# EAGLE design LowVBoard_01 (EAGLE 9.2.2)
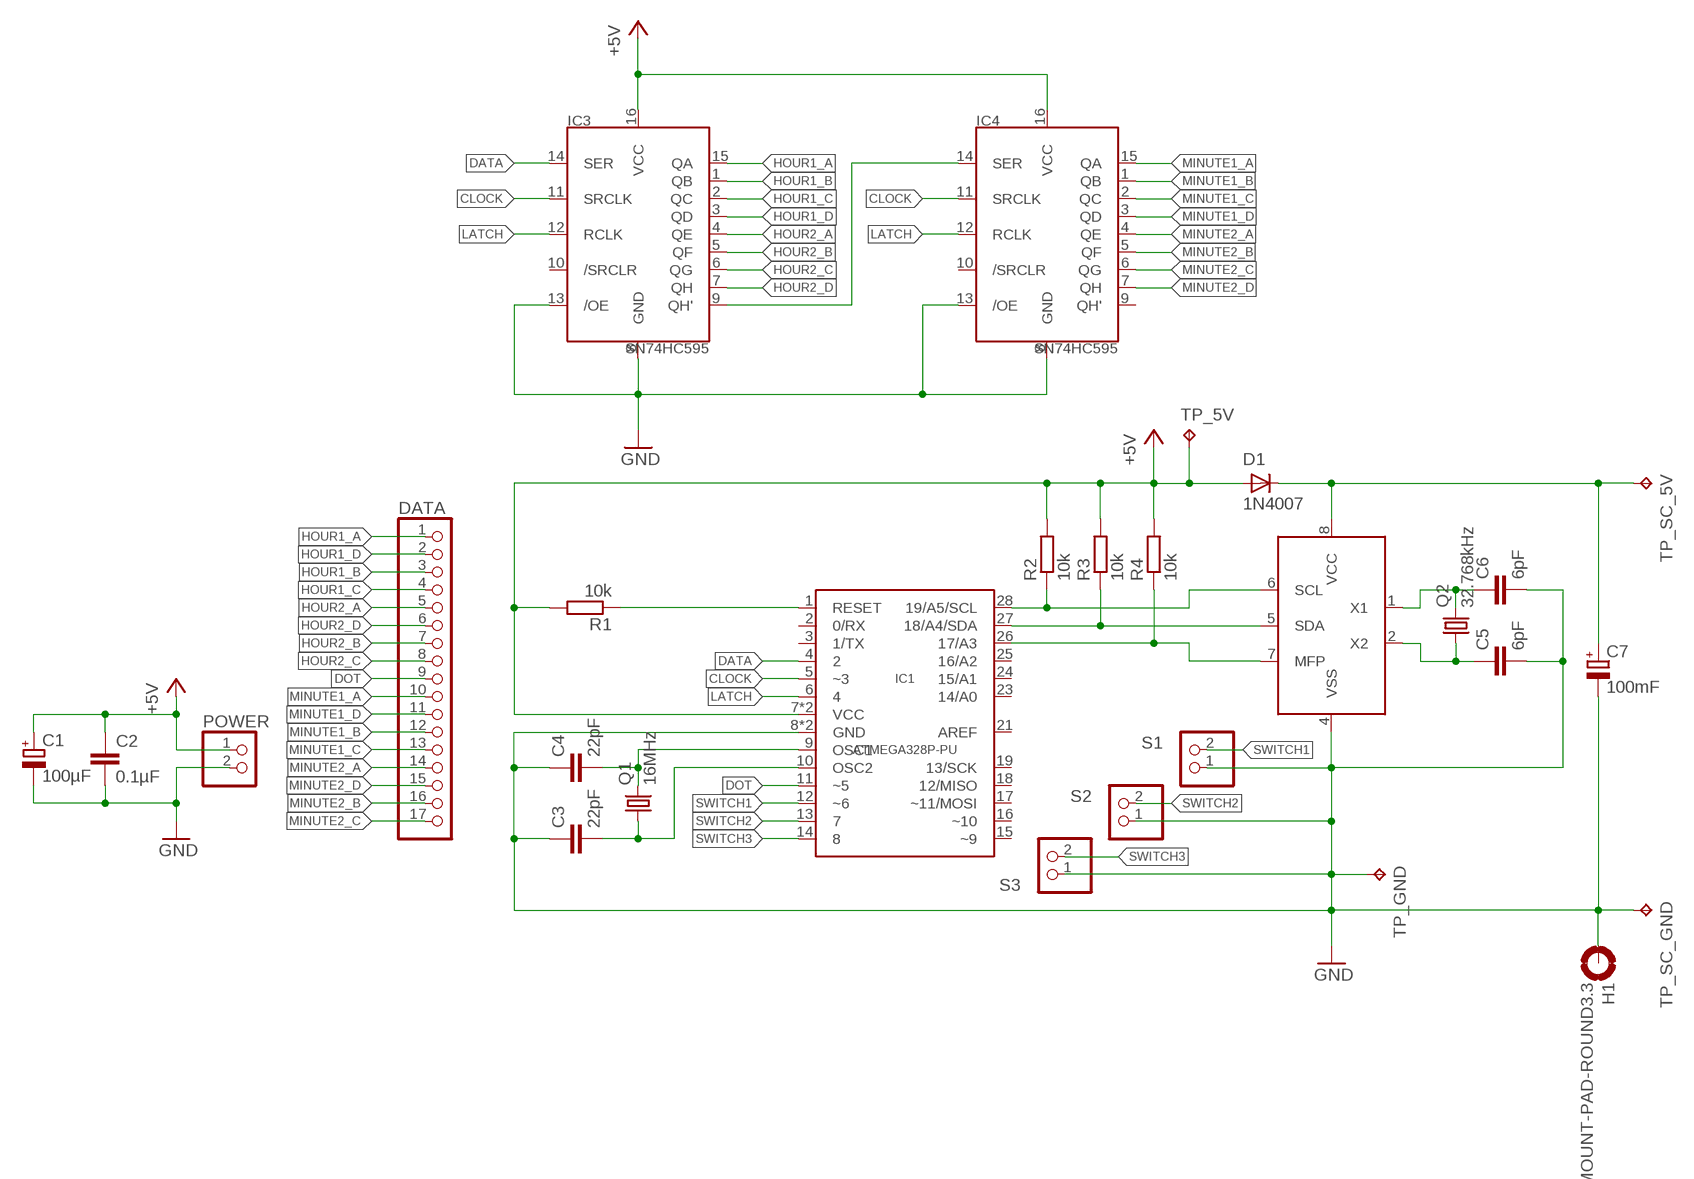
[diagram p0: schematic, sheet 1]

## Parts
C1  100µF  CPOL-EUE2-5  [E2-5]
C2  0.1µF  C-EU025-024X044  [C025-024X044]
C3  22pF  C-EU025-024X044  [C025-024X044]
C4  22pF  C-EU025-024X044  [C025-024X044]
C5  6pF  C-EU025-024X044  [C025-024X044]
C6  6pF  C-EU025-024X044  [C025-024X044]
C7  100mF  FTW0H104ZF  [SUPERCAP-11.5]
D1  1N4007  [DO41-7.6]
DATA  PINHD-1X17  [1X17]
H1  MOUNT-PAD-ROUND3.3  [3,3-PAD]
IC1  ATMEGA328P-PU  [DIP28]
IC2  MCP7940M  MCP7940M-I/P  [DIL8]
IC3  SN74HC595  [DIL16]
IC4  SN74HC595  [DIL16]
POWER  PINHD-1X2  [1X02]
Q1  16MHz  CRYSTALHC49S  [HC49/S]
Q2  32.768kHz  CFS-206  [CFS-206]
R1  10k  R-EU_0207/7  [0207/7]
R2  10k  R-EU_0207/7  [0207/7]
R3  10k  R-EU_0207/7  [0207/7]
R4  10k  R-EU_0207/7  [0207/7]
S1  PINHD-1X2/90  [1X02/90]
S2  PINHD-1X2/90  [1X02/90]
S3  PINHD-1X2/90  [1X02/90]
TP_5V  TPPAD1-13  [P1-13]
TP_GND  TPPAD1-13  [P1-13]
TP_SC_5V  TPPAD1-13  [P1-13]
TP_SC_GND  TPPAD1-13  [P1-13]

## Nets
+5V [+5V]: C1.+ C2.1 D1.A IC1.7(VCC) IC1.20(VCC) IC3.16(VCC) IC4.16(VCC) POWER.1 R1.2 R2.2 R3.2 R4.2 TP_5V.TP
CLOCK: IC1.5(~3) IC3.11(SRCLK) IC4.11(SRCLK)
DATA: IC1.4 IC3.14(SER)
DOT: DATA.9 IC1.11(~5)
GND [GND]: C1.- C2.2 C3.1 C4.1 C5.2 C6.2 C7.- H1.B3,3(MOUNT) IC1.8(GND) IC1.22(GND) IC2.4(VSS) IC3.8(GND) IC3.13(/OE) IC4.8(GND) IC4.13(/OE) POWER.2 S1.1 S2.1 S3.1 TP_GND.TP TP_SC_GND.TP
HOUR1_A: DATA.1 IC3.15(QA)
HOUR1_B: DATA.3 IC3.1(QB)
HOUR1_C: DATA.4 IC3.2(QC)
HOUR1_D: DATA.2 IC3.3(QD)
HOUR2_A: DATA.5 IC3.4(QE)
HOUR2_B: DATA.7 IC3.5(QF)
HOUR2_C: DATA.8 IC3.6(QG)
HOUR2_D: DATA.6 IC3.7(QH)
LATCH: IC1.6 IC3.12(RCLK) IC4.12(RCLK)
MINUTE1_A: DATA.10 IC4.15(QA)
MINUTE1_B: DATA.12 IC4.1(QB)
MINUTE1_C: DATA.13 IC4.2(QC)
MINUTE1_D: DATA.11 IC4.3(QD)
MINUTE2_A: DATA.14 IC4.4(QE)
MINUTE2_B: DATA.16 IC4.5(QF)
MINUTE2_C: DATA.17 IC4.6(QG)
MINUTE2_D: DATA.15 IC4.7(QH)
N$1: C7.+ D1.C IC2.8(VCC) TP_SC_5V.TP
N$53: C4.2 IC1.9(OSC1) Q1.2
N$54: C3.2 IC1.10(OSC2) Q1.1
N$56: IC1.1(RESET) R1.1
N$57: IC1.28(19/A5/SCL) IC2.6(SCL) R2.1
N$58: IC1.27(18/A4/SDA) IC2.5(SDA) R3.1
N$59: IC1.26(17/A3) IC2.7(MFP) R4.1
N$60: C6.1 IC2.1(X1) Q2.P$2
N$61: C5.1 IC2.2(X2) Q2.P$1
N$69: IC3.9(QH') IC4.14(SER)
SWITCH1: IC1.12(~6) S1.2
SWITCH2: IC1.13 S2.2
SWITCH3: IC1.14 S3.2
Unconnected: IC1.2(0/RX) IC1.3(1/TX) IC1.15(~9) IC1.16(~10) IC1.17(~11/MOSI) IC1.18(12/MISO) IC1.19(13/SCK) IC1.21(AREF) IC1.23(14/A0) IC1.24(15/A1) IC1.25(16/A2) IC3.10(/SRCLR) IC4.9(QH') IC4.10(/SRCLR)

## Library data of the parts
C1 = resistor:CPOL-EU: POLARIZED CAPACITOR, European symbol
C2-C6 = resistor:C-EU: CAPACITOR, European symbol
C7 = Nixie:FTW0H104ZF
D1 = Nixie:1N4007
DATA = pinhead:PINHD-1X17: PIN HEADER
H1 = holes:MOUNT-PAD-ROUND: MOUNTING PAD, round
IC1 = Programmer:ATMEGA328P-PU
IC2 = Nixie:MCP7940M-I/P
IC3 IC4 = Nixie:SN74HC595
POWER S1-S3 = pinhead:PINHD-1X2: PIN HEADER
Q1 = crystal:CRYSTAL: CRYSTAL; OC_FARNELL: 1667008; OC_NEWARK: unknown
Q2 = Nixie:CFS-206
R1-R4 = resistor:R-EU_: RESISTOR, European symbol
TP_5V TP_GND TP_SC_5V TP_SC_GND = testpad:TP: Test pad

## Net classes
0 SIGNAL: width 0.203 mm, clearance 0.203 mm
1 +5V: width 0.406 mm, clearance 0.203 mm
2 GND: clearance 0.203 mm

## Board
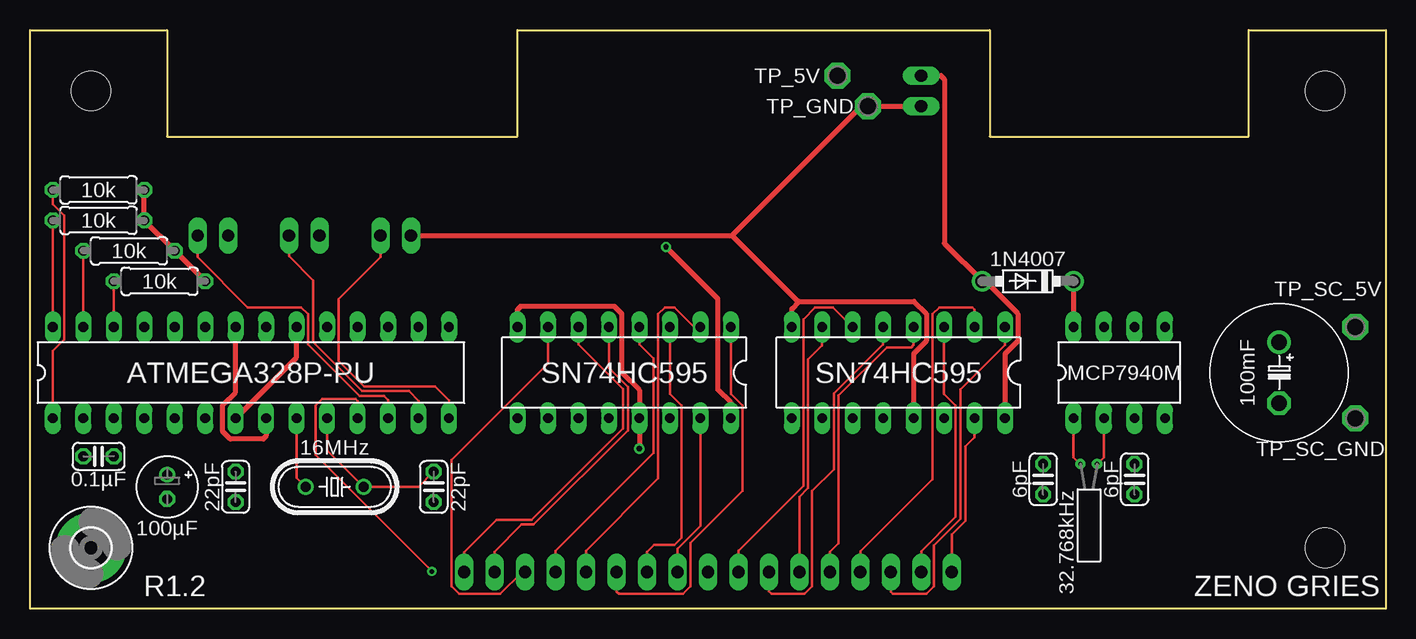
[diagram p1: board, top side]
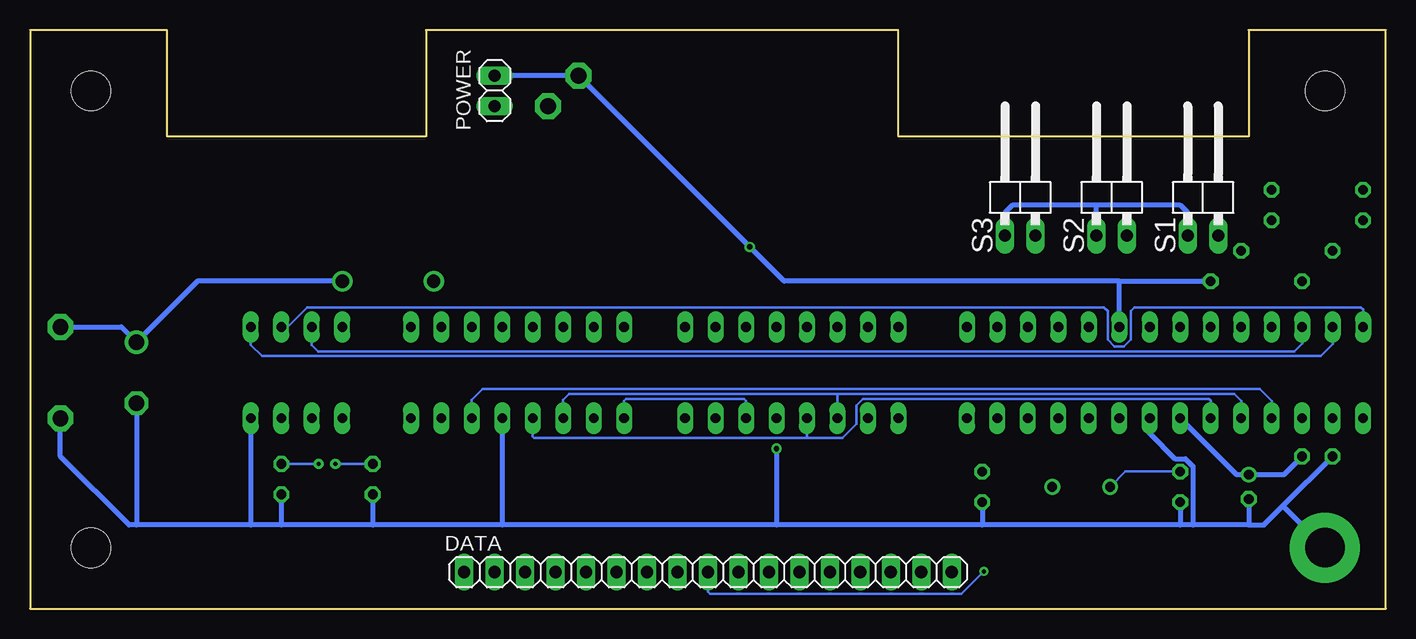
[diagram p2: board, bottom side, seen from below]

Size 113.03 x 48.26 mm. Coordinates in mm from the lower left corner, seen from the top.
Outline: 0,0 0,48.26 11.43,48.26 11.43,39.37 40.64,39.37 40.64,48.26 80.01,48.26 80.01,39.37 101.6,39.37 101.6,48.26 113.03,48.26 113.03,0 0,0
Copper layers (1*16): Top 0.035mm / dielectric 1.5mm / Bottom 0.035mm
Design rules "default": minimum track width 6mil, minimum drill 0.35mm, track to track 6mil, track to pad 6mil, pad to pad 6mil, via to via 6mil, smd to smd 6mil, copper to edge 40mil, drill to drill 6mil, minimum pad ring 10mil, minimum via ring 8mil, stop-mask expansion 4mil, vias tented up to drill 0mil, thermal gap 10mil
Holes 3.3 mm at 5.08,43.18 107.95,43.18 107.95,5.08

### Footprints (pad centres in the part's own frame; a part is rotated, then mirrored left to right if it is on the bottom)
E2-5 = drill 0.813 pad 1.27: + -1.016,0 | drill 0.813 pad 1.27 octagon: - 1.016,0
C025-024X044 = drill 0.813 octagon: 1 -1.27,0; 2 1.27,0
SUPERCAP-11.5 = drill 1.3: + -2.54,0 | drill 1.3 octagon: - 2.54,0
DO41-7.6 = drill 1.1 pad 1.7: A 3.81,0; C -3.81,0
1X17 = drill 1.016 long: 1 -20.32,0; 2 -17.78,0; 3 -15.24,0; 4 -12.7,0; 5 -10.16,0; 6 -7.62,0; 7 -5.08,0; 8 -2.54,0; 9 0,0; 10 2.54,0; 11 5.08,0; 12 7.62,0; 13 10.16,0; 14 12.7,0; 15 15.24,0; 16 17.78,0; 17 20.32,0
3,3-PAD = drill 3.3 pad 5.842: B3,3 0,0
DIP28 = drill 0.813 long: 1 -16.51,-3.81; 2 -13.97,-3.81; 3 -11.43,-3.81; 4 -8.89,-3.81; 5 -6.35,-3.81; 6 -3.81,-3.81; 7 -1.27,-3.81; 8 1.27,-3.81; 9 3.81,-3.81; 10 6.35,-3.81; 11 8.89,-3.81; 12 11.43,-3.81; 13 13.97,-3.81; 14 16.51,-3.81; 15 16.51,3.81; 16 13.97,3.81; 17 11.43,3.81; 18 8.89,3.81; 19 6.35,3.81; 20 3.81,3.81; 21 1.27,3.81; 22 -1.27,3.81; 23 -3.81,3.81; 24 -6.35,3.81; 25 -8.89,3.81; 26 -11.43,3.81; 27 -13.97,3.81; 28 -16.51,3.81
DIL8 = drill 0.813 long: 1 -3.81,-3.81; 2 -1.27,-3.81; 3 1.27,-3.81; 4 3.81,-3.81; 5 3.81,3.81; 6 1.27,3.81; 7 -1.27,3.81; 8 -3.81,3.81
DIL16 = drill 0.813 long: 1 -8.89,-3.81; 2 -6.35,-3.81; 3 -3.81,-3.81; 4 -1.27,-3.81; 5 1.27,-3.81; 6 3.81,-3.81; 7 6.35,-3.81; 8 8.89,-3.81; 9 8.89,3.81; 10 6.35,3.81; 11 3.81,3.81; 12 1.27,3.81; 13 -1.27,3.81; 14 -3.81,3.81; 15 -6.35,3.81; 16 -8.89,3.81
1X02 = drill 1.016 long: 1 -1.27,0; 2 1.27,0
HC49/S = drill 0.813: 1 -2.413,0; 2 2.413,0
CFS-206 = drill 0.35: P$1 0,-0.7; P$2 0,0.7
0207/7 = drill 0.813 octagon: 1 -3.81,0; 2 3.81,0
1X02/90 = drill 1.016 long: 1 -1.27,-3.81; 2 1.27,-3.81
P1-13 = drill 1.321 pad 2.159 octagon: TP 0,0

### Placement (x,y rotation side)
C1  11.43,10.16 270 top
C2  5.71,12.7 180 top
C3  33.66,10.16 90 top
C4  17.14,10.16 90 top
C5  92.08,10.79 270 top
C6  84.45,10.79 270 top
C7  104.14,19.68 270 top
D1  83.19,27.3 180 top
DATA  56.52,3.05 0 bottom
H1  5.08,5.08 0 top
IC1  18.41,19.68 0 top
IC2  90.81,19.68 0 top
IC3  72.39,19.68 180 top
IC4  49.53,19.68 180 top
POWER  74.3,43.18 270 bottom
Q1  25.4,10.16 180 top
Q2  88.27,12.06 90 top
R1  5.71,34.92 0 top
R2  5.71,32.38 0 top
R3  8.26,29.84 0 top
R4  10.79,27.3 0 top
S1  15.24,34.92 0 bottom
S2  22.86,34.92 0 bottom
S3  30.48,34.92 0 bottom
TP_5V  67.31,44.45 0 top
TP_GND  69.85,41.91 0 top
TP_SC_5V  110.49,23.5 0 top
TP_SC_GND  110.49,15.88 0 top

### Tracks (layer width: path | path; a pad name or v marks a point on that pad's centre or on a via)
+5V  (via drill 0.45)
  Top 0.406: POWER.1 75.95,44.45 76.22,44.17 76.22,30.45 D1.A 79.64,27.3 82.35,24.6 82.35,22.32 81.28,21.25 IC3.16 | IC1.7 22.23,20.95 IC1.20 | R4.2 R3.2 R2.2 R1.2 | IC4.16 58.42,17.18 57.35,18.25 57.35,25.83 v53.02,30.16
  Bottom 0.406: IC1.7 12.45,11.18 C1.+ 8.51,11.18 C2.1 | IC1.20 22.23,27.3 | 22.23,27.3 R4.2 | 22.23,27.3 50.16,27.3 v53.02,30.16 TP_5V.TP POWER.1
CLOCK
  Bottom 0.203: 45.72,17.91 IC4.11 | IC1.5 12.06,17.34 12.63,17.91 45.72,17.91 | 45.72,17.91 68.1,17.91 68.58,17.42 IC3.11
DATA
  Bottom 0.203: IC1.4 9.53,17.32 10.52,18.31 75.31,18.31 76.2,17.42 IC3.14
DOT  (via drill 0.35)
  Top 0.203: v33.5,3.1 23.8,12.81 23.8,16.93 24.36,17.5 27.13,17.5 27.3,17.32 IC1.11
  Bottom 0.203: DATA.9 56.52,1.41 56.32,1.22 35.4,1.22 33.75,2.87 33.73,2.87 v33.5,3.1
GND  (via drill 0.45)
  Top 0.406: v50.8,13.34 IC4.13 50.8,18.23 49.33,19.71 49.33,24.6 48.7,25.22 40.94,25.22 40.64,24.93 IC4.8 | 64.07,25.57 64.13,25.63 73.69,25.63 74.73,24.6 74.73,22.32 73.66,21.25 IC3.13 | 64.07,25.57 63.5,25 IC3.8 | S3.1 58.52,31.11 | 58.52,31.11 69.32,41.91 TP_GND.TP POWER.2 | 64.07,25.57 58.52,31.11 | IC1.8 19.68,14.39 19.44,14.15 16.7,14.15 16.08,14.77 16.08,16.98 17.14,18.04 IC1.22
  Bottom 0.406: 11.43,6.99 10.16,6.99 8.57,8.57 | 11.43,6.99 16.08,6.99 | 16.08,6.99 17.14,6.99 | 17.14,6.99 33.66,6.99 | 33.66,6.99 50.8,6.99 | 50.8,6.99 73.66,6.99 | 73.66,6.99 84.45,6.99 | 84.45,6.99 92.08,6.99 | 92.08,6.99 94.61,6.99 | 94.61,6.99 104.14,6.99 | 104.14,6.99 104.78,6.99 110.49,12.7 TP_SC_GND.TP | C7.- 104.14,6.99 | C5.2 92.08,6.99 | C6.2 84.45,6.99 | C3.1 33.66,6.99 | C4.1 17.14,6.99 | C1.- 11.43,6.99 | IC3.13 73.66,6.99 | v50.8,13.34 50.8,6.99 | IC1.8 19.68,14.61 17.58,12.5 16.7,12.5 16.08,11.87 16.08,6.99 | S1.1 16.51,33.02 17.14,33.66 24.13,33.66 | 24.13,33.66 31.11,33.66 31.75,33.02 S3.1 | S2.1 24.13,33.66 | IC2.4 94.61,6.99 | 8.57,8.57 C2.2 | 8.57,8.57 H1.B3,3
HOUR1_A
  Top 0.203: DATA.1 76.83,6.19 77.98,7.33 77.98,13.51 78.74,14.28 IC3.15
HOUR1_B
  Top 0.203: DATA.3 71.75,1.41 71.95,1.22 74.74,1.22 75.36,1.84 75.36,5.29 77.57,7.5 77.57,18.26 81.28,21.97 IC3.1
HOUR1_C
  Top 0.203: DATA.4 69.22,4.78 75.23,10.79 75.23,24.55 75.8,25.12 78.58,25.12 78.74,24.96 IC3.2
HOUR1_D
  Top 0.203: IC3.3 76.2,17.9 77.17,16.93 77.17,7.67 74.3,4.8 DATA.2
HOUR2_A
  Top 0.203: DATA.5 66.67,4.72 67.41,5.46 67.41,17.76 71.44,21.79 73.48,21.79 73.66,21.97 IC3.4
HOUR2_B
  Top 0.203: DATA.7 61.59,1.44 61.81,1.22 64.58,1.22 65.2,1.84 65.2,9.82 67,11.63 67,17.93 71.12,22.05 IC3.5
HOUR2_C
  Top 0.203: DATA.8 59.05,4.83 64.47,10.24 64.47,24.13 65.46,25.12 66.95,25.12 IC3.6
HOUR2_D
  Top 0.203: IC3.7 66.04,21.96 64.87,20.8 64.87,10.07 64.14,9.33 DATA.6
LATCH
  Bottom 0.203: IC1.6 14.61,17.37 14.74,17.5 43.58,17.5 44.15,16.93 44.15,15.42 45.32,14.25 48.26,14.25 | IC4.12 48.26,14.25 | 48.26,14.25 70.99,14.25 71.12,14.38 IC3.12
MINUTE1_A
  Top 0.203: DATA.10 53.98,5 55.88,6.91 IC4.15
MINUTE1_B
  Top 0.203: IC4.1 58.42,17.9 59.38,16.93 59.38,9.84 55.04,5.5 55.04,1.84 54.42,1.22 49.1,1.22 48.9,1.42 DATA.12
MINUTE1_C
  Top 0.203: IC4.2 55.37,23.5 53.74,25.12 52.94,25.12 52.38,24.55 52.38,10.85 46.35,4.83 DATA.13
MINUTE1_D
  Top 0.203: DATA.11 51.44,4.75 52.02,5.33 53.72,5.33 54.3,5.92 54.3,16.93 53.34,17.9 IC4.3
MINUTE2_A
  Top 0.203: DATA.14 43.81,4.83 51.97,12.98 51.97,20.85 50.8,22.02 IC4.4
MINUTE2_B
  Top 0.203: DATA.16 38.73,4.75 41,7.01 42,7.01 49.84,14.85 49.84,18.48 48.26,20.06 IC4.5
MINUTE2_C
  Top 0.203: IC4.6 45.72,22.02 49.43,18.31 49.43,15.02 41.83,7.42 38.9,7.42 36.2,4.71 DATA.17
MINUTE2_D
  Top 0.203: IC4.7 43.18,20.45 35.13,12.39 35.13,1.84 35.75,1.22 39.18,1.22 41.01,3.05 DATA.15
N$1
  Top 0.406: D1.C IC2.8
  Bottom 0.406: D1.C 99.06,27.3 C7.+ 105.41,23.5 TP_SC_5V.TP
N$53
  Top 0.203: IC1.9 22.23,10.92 Q1.2
  Bottom 0.203: C4.2 21.72,11.43 Q1.2
N$54
  Top 0.203: IC1.10 24.77,13.21 Q1.1 32.38,10.16 C3.2
N$56
  Top 0.203: R1.1 1.91,33.75 2.87,32.78 2.87,22.43 1.91,21.47 IC1.1
N$57
  Top 0.203: R2.1 IC1.28
  Bottom 0.203: IC1.28 1.91,24.94 2.09,25.12 20.96,25.12 21.26,24.82 21.26,22.43 21.82,21.87 22.62,21.87 23.19,22.43 23.19,24.82 23.49,25.12 89.94,25.12 91.56,23.5 IC2.6
N$58
  Top 0.203: R3.1 IC1.27
  Bottom 0.203: IC1.27 4.45,22.05 5.44,21.06 93.67,21.06 94.61,22 IC2.5
N$59
  Top 0.203: R4.1 IC1.26
  Bottom 0.203: IC1.26 6.99,22.1 7.62,21.46 89,21.46 89.53,22 IC2.7
N$60
  Top 0.203: IC2.1 87,12.63 Q2.P$2
  Bottom 0.203: C6.1 Q2.P$2
N$61
  Top 0.203: IC2.2 89.53,12.63 Q2.P$1
  Bottom 0.203: Q2.P$1 C5.1
N$69
  Bottom 0.203: IC3.9 63.5,17.32 63.32,17.5 53.52,17.5 53.34,17.32 IC4.14
SWITCH1
  Top 0.203: IC1.12 29.84,17.4 29.52,17.73 27.48,17.73 23.19,22.02 23.19,24.55 22.62,25.12 18.16,25.12 13.97,29.31 S1.2
SWITCH2
  Top 0.203: S2.2 21.59,29.39 23.6,27.38 23.6,22.23 27.69,18.14 31.59,18.14 32.38,17.34 IC1.13
SWITCH3
  Top 0.203: S3.2 29.21,29.31 25.73,25.83 25.73,20.67 27.85,18.54 33.75,18.54 34.92,17.37 IC1.14

### Text on the board
tNames: R1.2 | ZENO GRIES